# EAGLE design FridgeWarninig_0.2 (EAGLE 7.0.0)
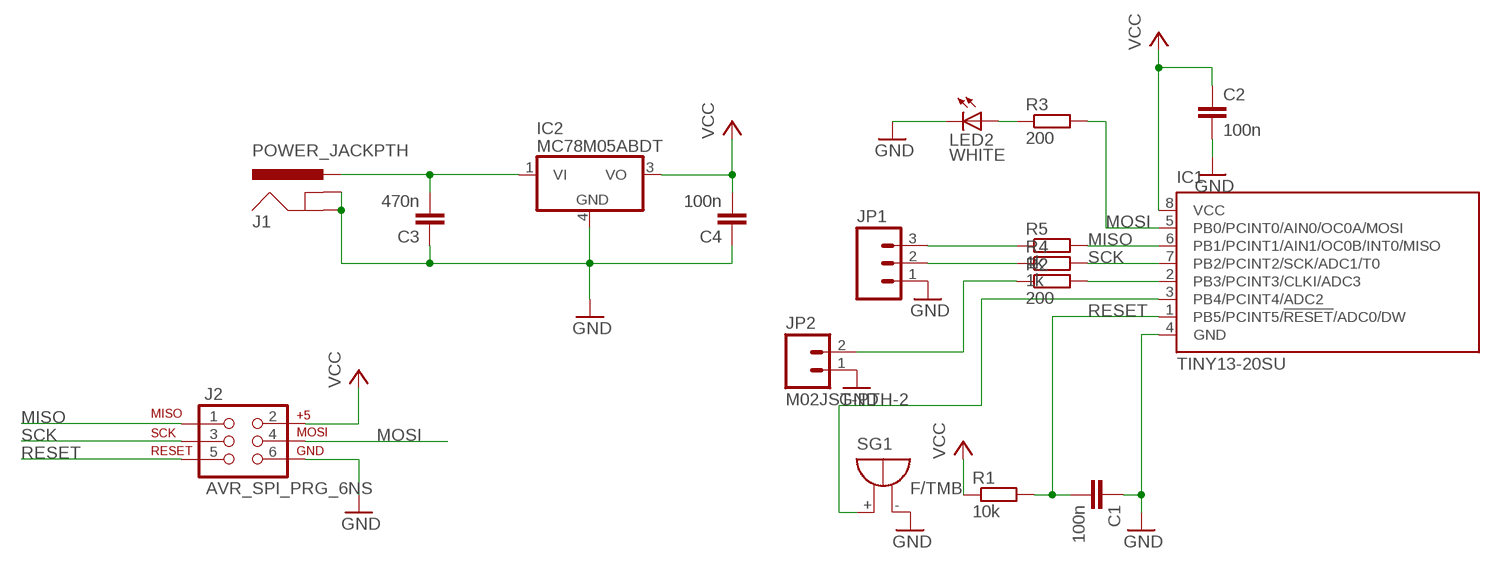
[diagram p0: schematic, sheet 1]

## Parts
C1  100n  C-EUC0805  [C0805]
C2  100n  C-EUC0805  [C0805]
C3  470n  C-EUC0805  [C0805]
C4  100n  C-EUC0805  [C0805]
IC1  TINY13-20SU  [8S2]
IC2  MC78M05ABDT  [DPACK_3]
J1  POWER_JACKPTH  [POWER_JACK_PTH]
J2  AVR_SPI_PRG_6NS  [2X3-NS]
JP1  M03JST-PTH  [JST-3-PTH]
JP2  M02JST-PTH-2  [JST-2-PTH]
LED2  WHITE  LEDCHIP-LED0603  [CHIP-LED0603]
R1  10k  R-EU_R0805  [R0805]
R2  200  R-EU_R0805  [R0805]
R3  200  R-EU_R0603  [R0603]
R4  1k  R-EU_R0805  [R0805]
R5  1k  R-EU_R0805  [R0805]
SG1  F/TMB  [F/TMB]

## Nets
GND: C1.1 C2.2 C3.1 C4.1 IC1.4(GND) IC2.4(GND) J1.GND J1.GNDBREAK J2.6 JP1.1 JP2.1 LED2.C SG1.-
MISO: IC1.6(PB1/PCINT1/AIN1/OC0B/INT0/MISO) J2.1 R5.2
MOSI: IC1.5(PB0/PCINT0/AIN0/OC0A/MOSI) J2.4 R3.2
N$1: JP2.2 R2.1
N$2: C3.2 IC2.1(VI) J1.PWR
N$4: IC1.3(PB4/PCINT4/ADC2) SG1.+
N$5: IC1.2(PB3/PCINT3/CLKI/ADC3) R2.2
N$6: JP1.2 R4.1
N$7: LED2.A R3.1
N$8: JP1.3 R5.1
RESET: C1.2 IC1.1(PB5/PCINT5/!RESET!/ADC0/DW) J2.5 R1.2
SCK: IC1.7(PB2/PCINT2/SCK/ADC1/T0) J2.3 R4.2
VCC: C2.1 C4.2 IC1.8(VCC) IC2.3(VO) J2.2 R1.1

## Library data of the parts
C1-C4 = resistor:C-EU: CAPACITOR, European symbol
IC1 = atmel:TINY13: 8-bit AVR Microcontroller with 1K Bytes In-System Programmable Flash Source: http://www.atmel.com/dyn/resources/prod_documents/2535S.pdf; MPN: ATTINY13-20SU; OC_FARNELL: 9171568; OC_NEWARK: 96K6522
IC2 = linear:MC78M: 500 mA Positive Voltage Regulators Source: Data sheet <http://www.onsemi.com/pub_link/Collateral/MC78M00-D.PDF>
J1 = SparkFun-Connectors:POWER_JACK: Power Jack This is the standard 5.5mm barrel jack for power. The PTH is the most common, proven, reliable, footprint. The Slot footprint only works if the mill layer is transmitted to the PCB fab house so be warned. Mating wall wart : TOL-00298 (and others); PROD_ID: PRT-00119
J2 = SparkFun-Connectors:AVR_SPI_PRG_6: AVR ISP 6 Pin This is the reduced ISP connector for AVR programming. Common on Arduino. This footprint will take up less PCB space and can be used with a 10-pin to 6-pin adapter such as SKU: BOB-08508 **Special note about "TEST_POINT" package. The stop mask is on the top side, so if you want your programming test points to be on the bottom of your board, make sure to place this package on the bottom side of the board. This also ensure that the orientation to program from the bottom side will be correct.
JP1 = SparkFun-Connectors:M03: Header 3 Standard 3-pin 0.1" header. Use with straight break away headers (SKU : PRT-00116), right angle break away headers (PRT-00553), swiss pins (PRT-00743), machine pins (PRT-00117), and female headers (PRT-00115). Molex polarized connector foot print use with SKU : PRT-08232 with associated crimp pins and housings.; SKU: PRT-09915
JP2 = SparkFun-Connectors:M02: Standard 2-pin 0.1" header. Use with - straight break away headers ( PRT-00116) - right angle break away headers (PRT-00553) - swiss pins (PRT-00743) - machine pins (PRT-00117) - female headers (PRT-00115) Molex polarized connector foot print use with: PRT-08233 with associated crimp pins and housings. 2.54_SCREWTERM for use with PRT-10571. 3.5mm Screw Terminal footprints for PRT-08084 5mm Screw Terminal footprints for use with PRT-08433; SKU: PRT-09914
LED2 = led:LED: LED OSRAM: - CHIPLED LG R971, LG N971, LY N971, LG Q971, LY Q971, LO R971, LY R971 LH N974, LH R974 LS Q976, LO Q976, LY Q976 LO Q996 - Hyper CHIPLED LW Q18S LB Q993, LB Q99A, LB R99A - SideLED LS A670, LO A670, LY A670, LG A670, LP A670 LB A673, LV A673, LT A673, LW A673 LH A674 LY A675 LS A676, LA A676, LO A676, LY A676, LW A676 LS A679, LY A679, LG A679 - Hyper Micro SIDELED® LS Y876, LA Y876, LO Y876, LY Y876 LT Y87S - SmartLED LW L88C, LW L88S LB L89C, LB L89S, LG L890 LS L89K, LO L89K, LY L89K LS L896, LA L896, LO L896, LY L896 - TOPLED LS T670, LO T670, LY T670, LG T670, LP T670 LSG T670, LSP T670, LSY T670, LOP T670, LYG T670 LG T671, LOG T671, LSG T671 LB T673, LV T673, LT T673, LW T673 LH T674 LS T676, LA T676, LO T676, LY T676, LB T676, LH T676, LSB T676, LW T676 LB T67C, LV T67C, LT T67C, LS T67K, LO T67K, LY T67K, LW E67C LS E67B, LA E67B, LO E67B, LY E67B, LB E67C, LV E67C, LT E67C LW T67C LS T679, LY T679, LG T679 LS T770, LO T770, LY T770, LG T770, LP T770 LB T773, LV T773, LT T773, LW T773 LH T774 LS E675, LA E675, LY E675, LS T675 LS T776, LA T776, LO T776, LY T776, LB T776 LHGB T686 LT T68C, LB T68C - Hyper Mini TOPLED® LB M676 - Mini TOPLED Santana® LG M470 LS M47K, LO M47K, LY M47K Source: http://www.osram.convergy.de LUXEON: - LUMILED® LXK2-PW12-R00, LXK2-PW12-S00, LXK2-PW14-U00, LXK2-PW14-V00 LXK2-PM12-R00, LXK2-PM12-S00, LXK2-PM14-U00 LXK2-PE12-Q00, LXK2-PE12-R00, LXK2-PE12-S00, LXK2-PE14-T00, LXK2-PE14-U00 LXK2-PB12-K00, LXK2-PB12-L00, LXK2-PB12-M00, LXK2-PB14-N00, LXK2-PB14-P00, LXK2-PB14-Q00 LXK2-PR12-L00, LXK2-PR12-M00, LXK2-PR14-Q00, LXK2-PR14-R00 LXK2-PD12-Q00, LXK2-PD12-R00, LXK2-PD12-S00 LXK2-PH12-R00, LXK2-PH12-S00 LXK2-PL12-P00, LXK2-PL12-Q00, LXK2-PL12-R00 Source: www.luxeon.com KINGBRIGHT: KA-3528ASYC Source: www.kingbright.com
R1-R5 = resistor:R-EU_: RESISTOR, European symbol
SG1 = buzzer:F/TMB: BUZZER Source: Buerklin; OC_FARNELL: unknown; OC_NEWARK: unknown

## Board
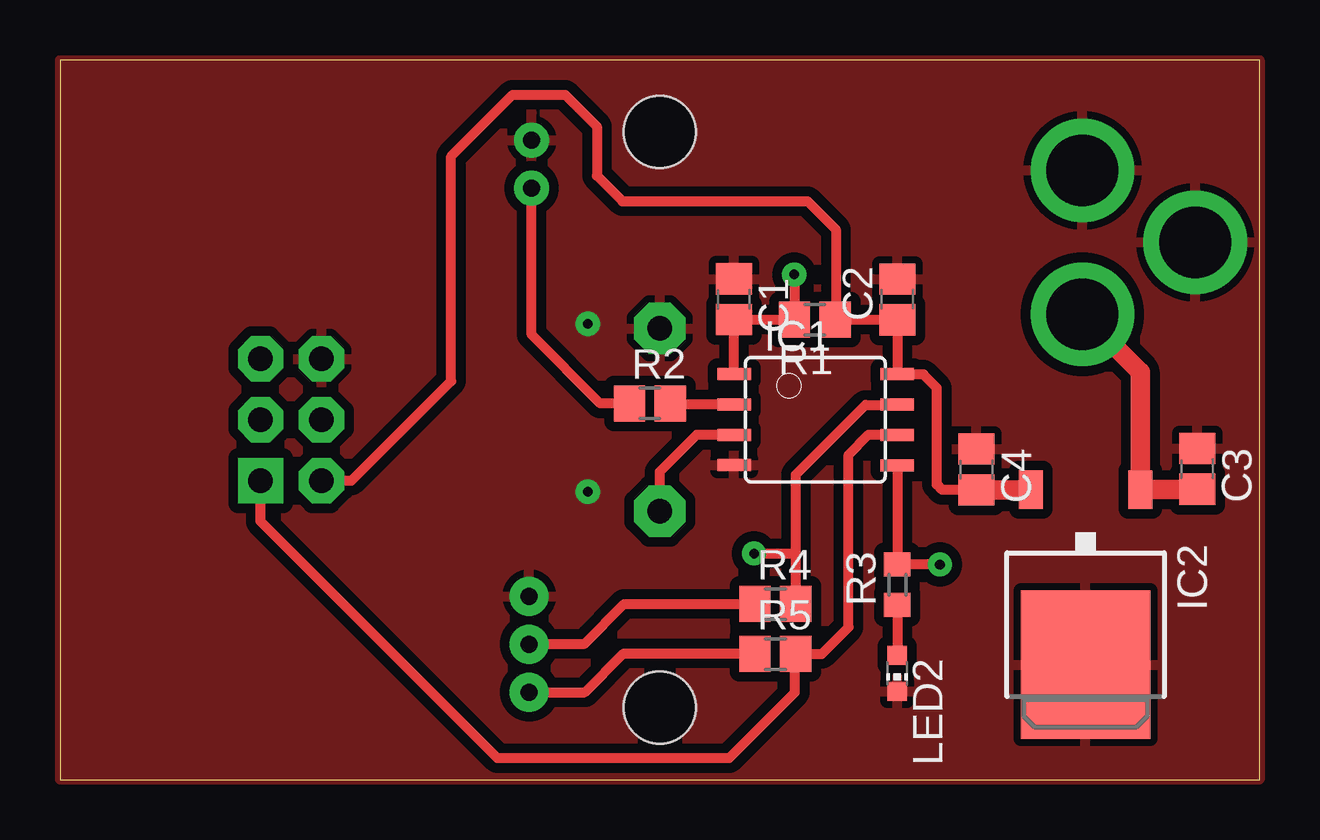
[diagram p1: board, top side]
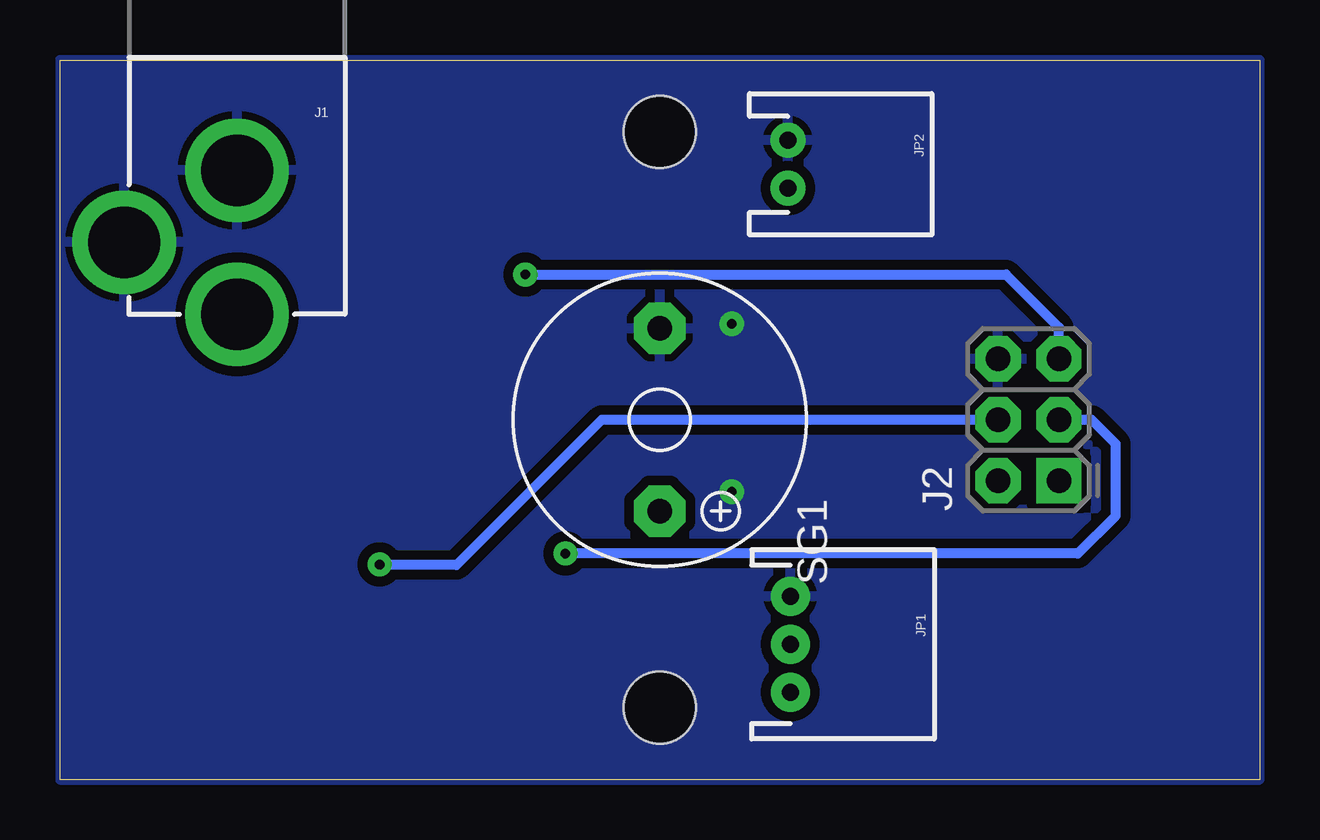
[diagram p2: board, bottom side, seen from below]

Size 50 x 30 mm. Coordinates in mm from the lower left corner, seen from the top.
Outline: 0,0 50,0 50,30 0,30 0,0
Copper layers (1*16): Top 0.035mm / dielectric 1.5mm / Bottom 0.035mm
Design rules "FridgeWarninig_0.1": minimum track width 8mil, minimum drill 0.4mm, track to track 16mil, track to pad 12mil, pad to pad 8mil, via to via 10mil, smd to smd 8mil, copper to edge 0mil, drill to drill 8mil, minimum pad ring 10mil, minimum via ring 12mil, stop-mask expansion 4mil, vias tented up to drill 0mil, thermal gap 12mil
Holes 3 mm at 25,3 25,27

### Footprints (pad centres in the part's own frame; a part is rotated, then mirrored left to right if it is on the bottom)
C0805 = smd 1.3 x 1.5: 1 -0.85,0; 2 0.85,0
8S2 = smd 0.5 x 1.4: 1 -1.905,-3.404; 2 -0.645,-3.404; 3 0.625,-3.404; 4 1.895,-3.404; 5 1.905,3.404; 6 0.635,3.404; 7 -0.635,3.404; 8 -1.905,3.404
DPACK_3 = smd 1 x 1.6: 1 -2.28,-4.8; 3 2.28,-4.8 | smd 5.4 x 6.2: 4 0,2.5
POWER_JACK_PTH = drill 2.997 pad 4.318: GND 0,7.7; GNDBREAK 4.7,10.7; PWR 0,13.7
2X3-NS = drill 1.016 pad 1.88 square: 1 -2.54,-1.27 | drill 1.016 pad 1.88 octagon: 2 -2.54,1.27; 3 0,-1.27; 4 0,1.27; 5 2.54,-1.27; 6 2.54,1.27
JST-3-PTH = drill 0.7 pad 1.626: 1 -2,0; 2 0,0; 3 2,0
JST-2-PTH = drill 0.7 pad 1.448: 1 -1,0; 2 1,0
CHIP-LED0603 = smd 0.8 x 0.8: A 0,-0.75; C 0,0.75
R0805 = smd 1.3 x 1.5: 1 -0.85,0; 2 0.85,0
R0603 = smd 1 x 1.1: 1 -0.85,0; 2 0.85,0
F/TMB = drill 1.016 pad 2.159 octagon: + 3.81,0; - -3.81,0

### Placement (x,y rotation side)
C1  28.09,20.02 270 top
C2  34.9,20.02 90 top
C3  47.4,12.95 270 top
C4  38.2,12.93 270 top
IC1  31.5,15 270 top
IC2  42.75,7.29 180 top
J1  42.62,33.1 180 bottom
J2  9.63,15 90 bottom
JP1  19.56,5.64 270 bottom
JP2  19.66,25.65 270 bottom
LED2  34.9,4.43 180 top
R1  31.46,19.17 180 top
R2  24.59,15.68 0 top
R3  34.9,8.13 90 top
R4  29.82,7.32 0 top
R5  29.82,5.23 0 top
SG1  25,15 270 bottom

### Tracks (layer width: path | path; a pad name or v marks a point on that pad's centre or on a via)
GND  (via drill 0.4)
  other vias: 22,19 22,12
  pour Top: 0,0 0,30 50,30 50,0
  pour Bottom: 0,0 0,30 50,30 50,0
MISO
  Top 0.406: IC1.6 33.71,14.38 32.87,13.54 32.87,6.35 31.75,5.23 R5.2 30.66,5.05 30.66,4.7 30.63,4.67 | 30.63,4.67 30.53,4.67 | J2.1 8.36,10.77 18.24,0.89 27.89,0.89 30.63,3.63 30.63,4.67
MOSI  (via drill 0.4)
  Top 0.254: 34.9,13.06 34.87,13.08 34.87,13.11 IC1.5
  Top 0.406: 34.9,13.06 R3.2 34.91,8.97 v36.68,8.97
  Bottom 0.406: v36.68,8.97 36.65,8.94 33.48,8.94 27.42,15 J2.4
N$1
  Top 0.406: R2.1 22.52,15.68 19.66,18.54 JP2.2
N$2
  Top 0.406: 47.38,12.09 C3.2
  Top 0.813: 47.38,12.09 IC2.1 45.03,16.99 J1.PWR
N$3
  pour Top: 0,0 0,30 50,30 50,0
N$4
  Top 0.406: IC1.3 26.54,14.38 24.99,12.83 SG1.+
N$5
  Top 0.406: IC1.2 25.44,15.64 R2.2
N$6
  Top 0.406: JP1.2 19.58,5.66 21.87,5.66 23.52,7.32 R4.1
N$7
  Top 0.406: R3.1 LED2.A
N$8
  Top 0.406: JP1.3 21.88,3.64 23.5,5.26 28.94,5.26 R5.1
RESET  (via drill 0.4)
  Top 0.406: IC1.1 C1.2 R1.2 v30.61,21.06
  Bottom 0.406: v30.61,21.06 10.57,21.06 8.36,18.85 J2.5
SCK  (via drill 0.4)
  Top 0.406: R4.2 30.67,9.42 | 30.67,9.42 30.67,12.71 33.58,15.62 IC1.7 | v28.93,9.42 30.67,9.42
  Bottom 0.406: v28.93,9.42 7.58,9.42 6,11 6,14 7,15 J2.3
VCC
  Top 0.406: C4.2 36.77,12.08 36.55,12.29 36.55,16.33 35.99,16.89 34.92,16.89 IC1.8 C2.1 R1.1 32.33,19.19 32.33,22.94 31.17,24.11 23.44,24.11 22.38,25.17 22.38,27.23 21.06,28.55 18.87,28.55 16.31,25.98 16.31,16.61 12.15,12.46 J2.2 | 40.46,12.08 IC2.3
  Top 0.813: C4.2 40.46,12.08